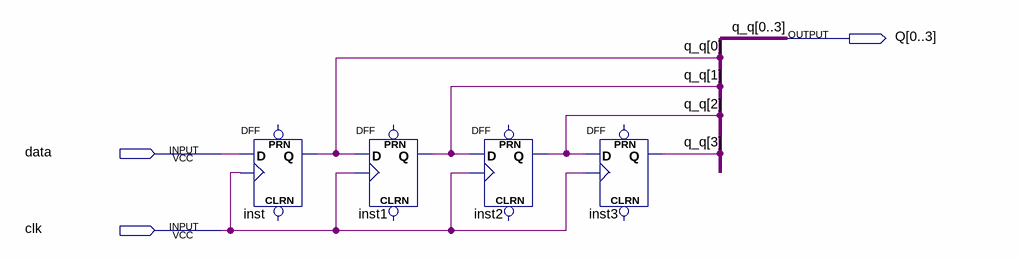
[diagram p0: schematic sheet]
// Quartus schematic serial_parallel_register.bdf as structural Verilog: 4 symbols, 3 pins
module serial_parallel_register (
  input  data,
  input  clk,
  output [0:3] Q
);

  DFF inst (.CLK(clk), .D(data), .Q(Q[0]));  // open: CLRN, PRN
  DFF inst1 (.CLK(clk), .D(Q[0]), .Q(Q[1]));  // open: CLRN, PRN
  DFF inst2 (.CLK(clk), .D(Q[1]), .Q(Q[2]));  // open: CLRN, PRN
  DFF inst3 (.CLK(clk), .D(Q[2]), .Q(Q[3]));  // open: CLRN, PRN

  // Other names for the same wires on the sheet: q_q[3:0] = {Q[3], Q[2], Q[1], Q[0]}
endmodule
